# Altium schematic sheet gsa28.SchDoc
size A; SheetNumber: 9; SheetTotal: 20
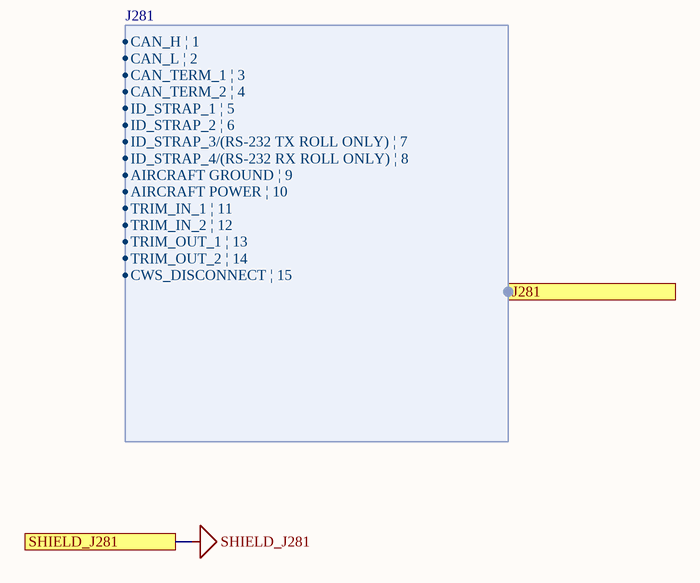
[diagram p0: gsa28.SchDoc]

## Ports
J281 (harness J281), SHIELD_J281

## Harnesses
J281: CAN_H | 1, CAN_L | 2, CAN_TERM_1 | 3, CAN_TERM_2 | 4, ID_STRAP_1 | 5, ID_STRAP_2 | 6, ID_STRAP_3/(RS-232 TX ROLL ONLY) | 7, ID_STRAP_4/(RS-232 RX ROLL ONLY) | 8, TRIM_IN_1 | 11, TRIM_IN_2 | 12, AIRCRAFT GROUND | 9, AIRCRAFT POWER | 10, TRIM_OUT_1 | 13, TRIM_OUT_2 | 14, CWS_DISCONNECT | 15

## Nets
SHIELD_J281: port SHIELD_J281